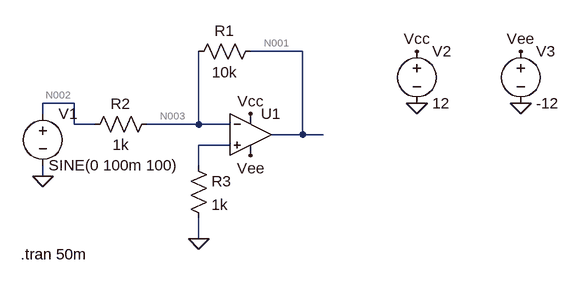
[diagram p0: schematic Amplificator_Inversor_AO.asc]
Amplificator_Inversor_AO.asc, the LTspice schematic file:
Version 4
SHEET 1 880 680
WIRE 288 48 208 48
WIRE -64 128 -112 128
WIRE -112 144 -112 128
WIRE -64 160 -64 128
WIRE -32 160 -64 160
WIRE 128 160 128 48
WIRE 128 160 48 160
WIRE 176 160 128 160
WIRE 288 176 288 48
WIRE 288 176 240 176
WIRE 320 176 288 176
WIRE 176 192 128 192
WIRE 128 224 128 192
WIRE -112 240 -112 224
WIRE 128 336 128 304
FLAG 128 336 0
FLAG -112 240 0
FLAG 464 48 Vcc
FLAG 208 144 Vcc
FLAG 624 48 Vee
FLAG 208 208 Vee
FLAG 464 128 0
FLAG 624 128 0
SYMBOL res 224 32 R90
WINDOW 0 0 56 VBottom 2
WINDOW 3 32 56 VTop 2
SYMATTR InstName R1
SYMATTR Value 10k
SYMBOL res 64 144 R90
WINDOW 0 0 56 VBottom 2
WINDOW 3 32 56 VTop 2
SYMATTR InstName R2
SYMATTR Value 1k
SYMBOL voltage -112 128 R0
WINDOW 3 9 95 Left 2
WINDOW 123 0 0 Left 0
WINDOW 39 24 72 Left 2
SYMATTR Value SINE(0 100m 100)
SYMATTR InstName V1
SYMBOL res 112 208 R0
SYMATTR InstName R3
SYMATTR Value 1k
SYMBOL OpAmps\\UniversalOpAmp 208 176 R0
SYMATTR InstName U1
SYMBOL voltage 464 32 R0
WINDOW 123 0 0 Left 0
WINDOW 39 0 0 Left 0
SYMATTR InstName V2
SYMATTR Value 12
SYMBOL voltage 624 32 R0
WINDOW 123 0 0 Left 0
WINDOW 39 0 0 Left 0
SYMATTR InstName V3
SYMATTR Value -12
TEXT -146 360 Left 2 !.tran 50m

The netlist it stands for:
* Amplificator_Inversor_AO.asc
R1 N001 N003 10k
R2 N003 N002 1k
V1 N002 0 SINE(0 100m 100)
R3 N004 0 1k
XU1 N004 N003 Vcc Vee N001 level1 Avol=1Meg GBW=10Meg Vos=0 En=0 Enk=0 In=0 Ink=0 Rin=500Meg  ; pins In+ In- V+ V- OUT
V2 Vcc 0 12
V3 Vee 0 -12
.tran 50m
.lib UniversalOpAmp1.lib
.backanno
.end

* Results of the author's LTspice run, read from the files saved beside the schematic
* Operating Point, zero values left out:
*   V(vcc) = 12 V
*   V(vee) = -12 V
*   I(V3) = 24 nA
*   I(V2) = -24 nA
*   Ix(u1:3) = 24 nA
*   Ix(u1:4) = -24 nA
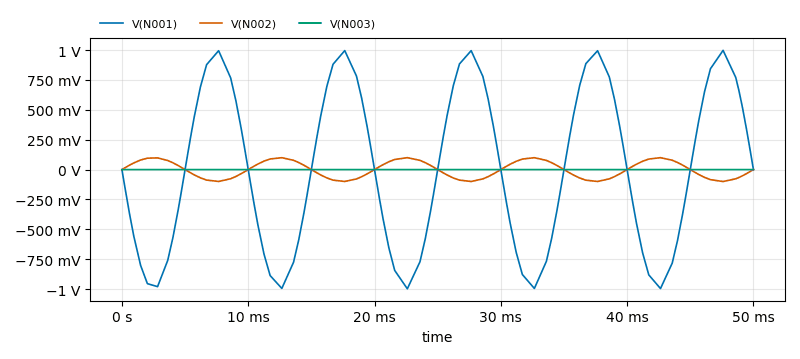
[diagram p1: Transient Analysis of Amplificator_Inversor_AO.asc, plotted from the saved traces]
* Transient Analysis, 1 run:
*   V(N001): min -996.9 mV, max 996.9 mV, average -258.8 µV, rms 695.7 mV, last 110 µV
*   V(N002): min -99.72 mV, max 99.72 mV, average 25.89 µV, rms 69.59 mV, last 0 V
*   V(N003): min -10.05 µV, max 10.32 µV, average 101.5 pV, rms 7.214 µV, last 10 µV